# EAGLE design Gravador (EAGLE 6.6.0)
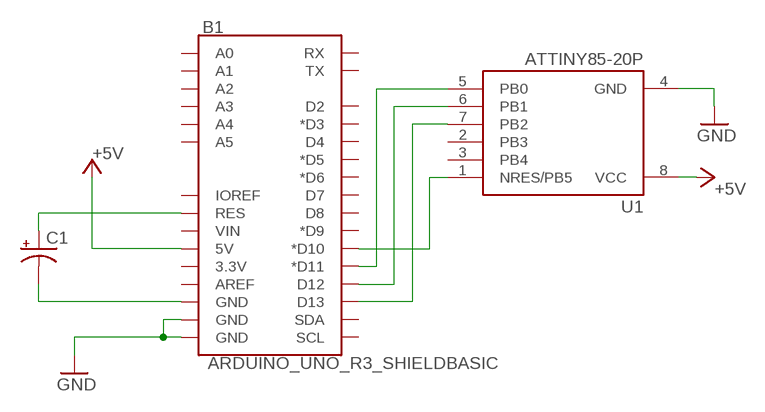
[diagram p0: schematic, sheet 1]

## Parts
B1  ARDUINO_UNO_R3_SHIELDBASIC  [UNO_R3_SHIELD]
C1  CPOL-USE2.5-5  [E2,5-5]
U1  ATTINY85-20P  [PDIP08_300MIL]

## Nets
+5V: B1.5V U1.8(VCC)
GND: B1.GND@0(GND) B1.GND@1(GND) U1.4(GND)
GND1: B1.GND@2(GND) C1.-
N$1: B1.RES C1.+
N$2: B1.D13 U1.7(PB2)
N$3: B1.D12 U1.6(PB1)
N$4: B1.D11(*D11) U1.5(PB0)
N$5: B1.D10(*D10) U1.1(NRES/PB5)
Unconnected: B1.3.3V B1.A0 B1.A1 B1.A2 B1.A3 B1.A4 B1.A5 B1.AREF B1.D2 B1.D3(*D3) B1.D4 B1.D5(*D5) B1.D6(*D6) B1.D7 B1.D8 B1.D9(*D9) B1.IOREF B1.RX B1.SCL B1.SDA B1.TX B1.VIN U1.2(PB3) U1.3(PB4)

## Library data of the parts
B1 = Robotica-IFRN-SC-Arduino:ARDUINO_UNO_R3_SHIELD: Arduino R3 Shield Footprint Shield form compatible with the Arduino Uno R3. SparkFun Products: MG2639 Cellular Shield <https://www.sparkfun.com/products/13120> MIDI Shield <https://www.sparkfun.com/products/12898> R3 Stackable Headers Kit <https://www.sparkfun.com/products/11417>
C1 = rcl:CPOL-US: POLARIZED CAPACITOR, American symbol
U1 = _hhn_attiny25_45_85:ATTINY85*: ATMEL ATtiny 85 Packages: P = PDIP 08 30mil S = SOIC 08 EIAJ 208mil Technologies Note: for complete ordering code (temp. range, finish, tape&reel etc.) see www.atmel.com • Supply Voltage: V = (1.8…5.5)V | [blank] = (2.7…5.5)V • Speed: 10 = 10 MHz | 20 = 20 MHz Author: Dipl.-Ing. FH Rainer Bayer HHN Hochschule Heilbronn (Heilbronn University), rainer.bayer@hs-heilbronn.de Ingenieurbüro ing-rb, mail@ing-rb.de

## Board
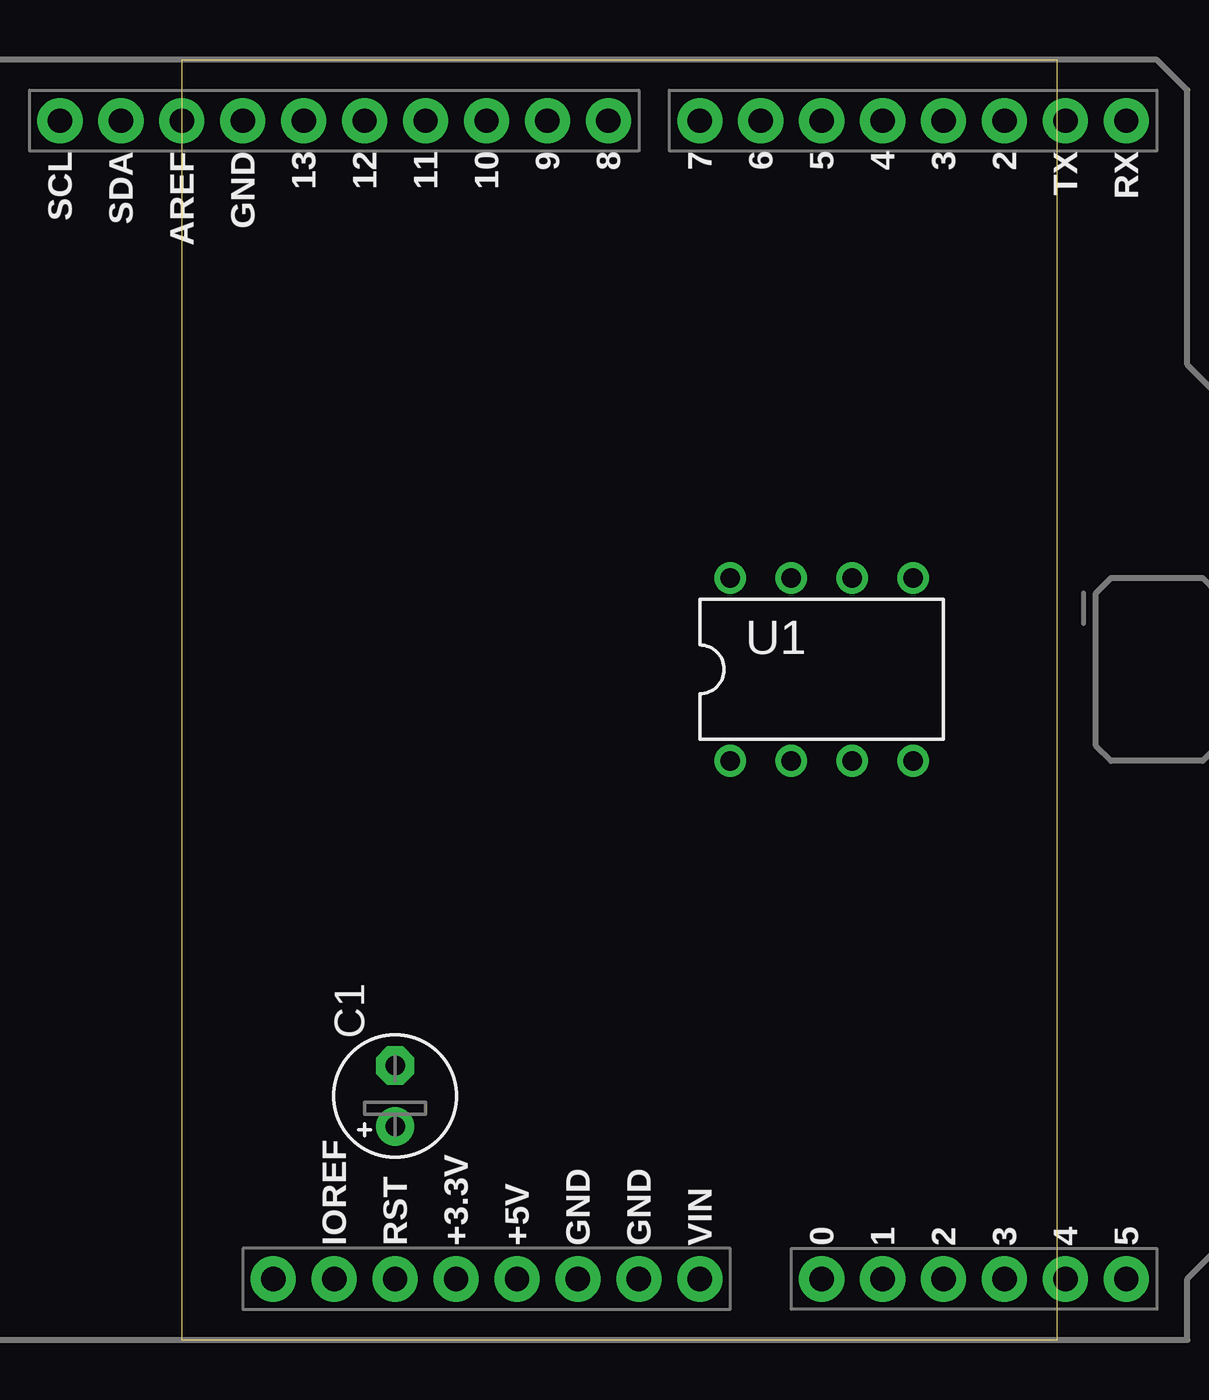
[diagram p1: board, top side]
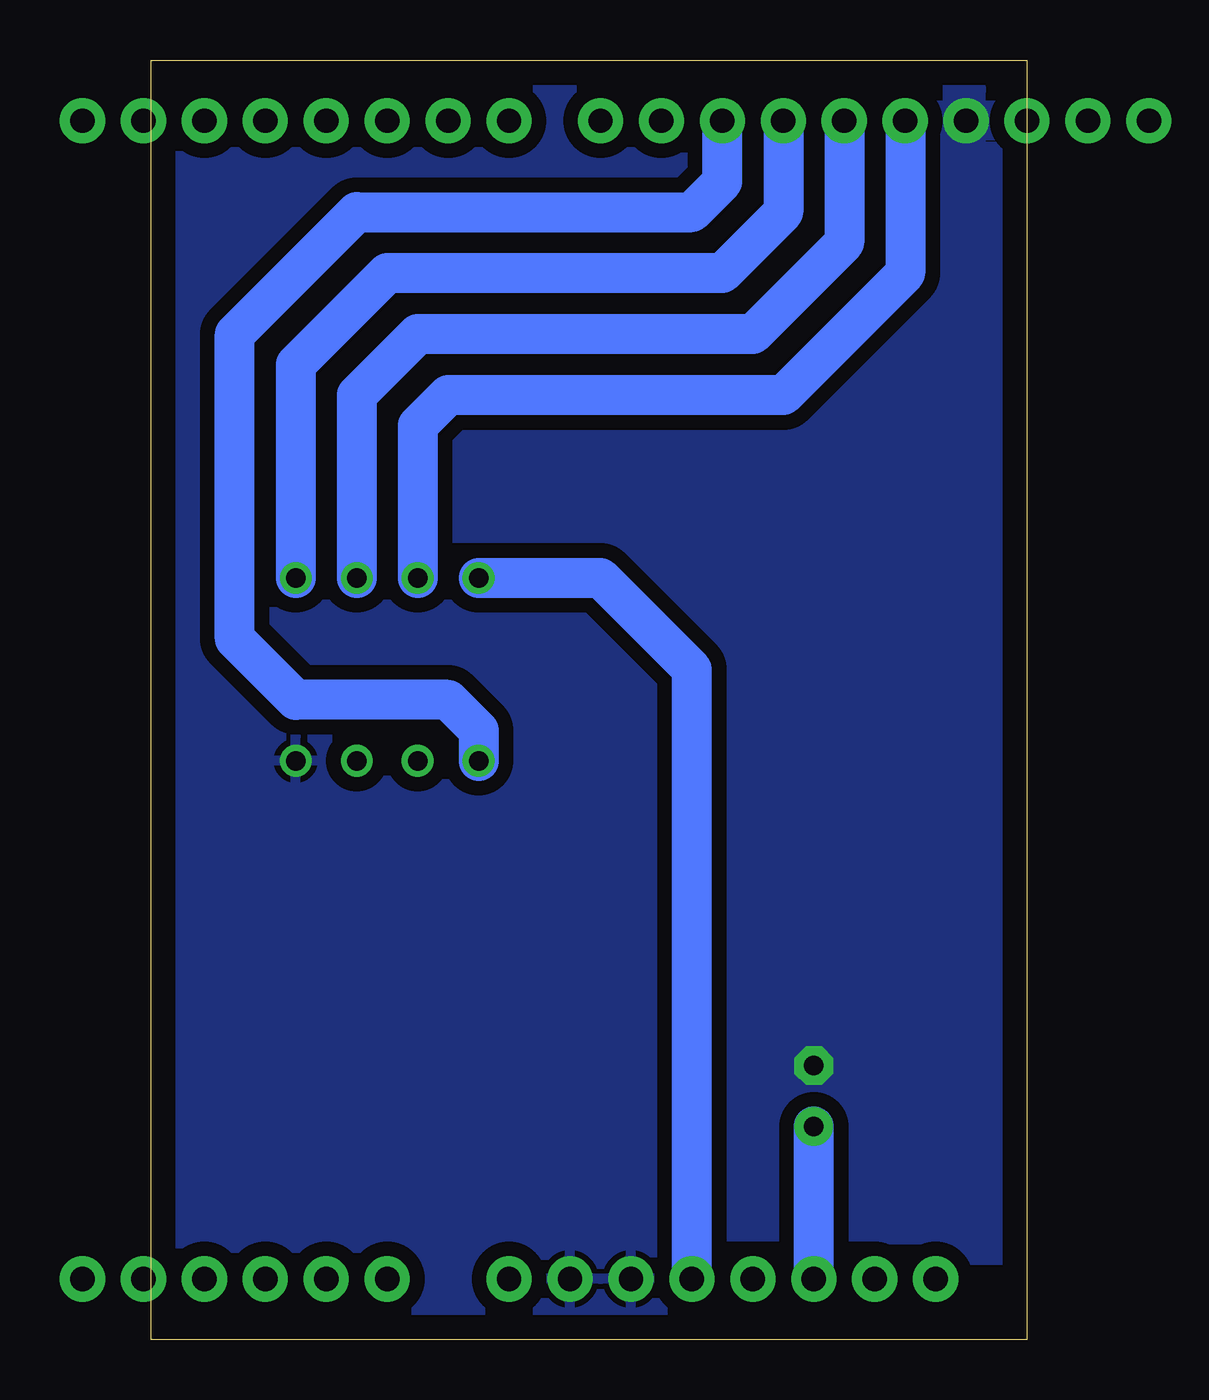
[diagram p2: board, bottom side, seen from below]

Size 36.5 x 53.33 mm. Coordinates in mm from the lower left corner, seen from the top.
Outline: 0,0 36.5,0 36.5,53.33 0,53.33 0,0
Copper layers (1*16): Top 0.035mm / dielectric 1.5mm / Bottom 0.035mm
Design rules "default *": minimum track width 10mil, minimum drill 24mil, track to track 24mil, track to pad 24mil, pad to pad 24mil, via to via 24mil, smd to smd 8mil, copper to edge 40mil, drill to drill 8mil, minimum pad ring 10mil, minimum via ring 8mil, stop-mask expansion 4mil, vias tented up to drill 0mil, thermal gap 10mil

### Footprints (pad centres in the part's own frame; a part is rotated, then mirrored left to right if it is on the bottom)
UNO_R3_SHIELD = drill 1.016 pad 1.88: 3.3V 24.13,-2.54; 5V 24.13,0; A0 24.13,12.7; A1 24.13,15.24; A2 24.13,17.78; A3 24.13,20.32; A4 24.13,22.86; A5 24.13,25.4; AREF -24.13,-13.97; D2 -24.13,20.32; D3 -24.13,17.78; D4 -24.13,15.24; D5 -24.13,12.7; D6 -24.13,10.16; D7 -24.13,7.62; D8 -24.13,3.81; D9 -24.13,1.27; D10 -24.13,-1.27; D11 -24.13,-3.81; D12 -24.13,-6.35; D13 -24.13,-8.89; GND@0 24.13,2.54; GND@1 24.13,5.08; GND@2 -24.13,-11.43; IOREF 24.13,-7.62; NC 24.13,-10.16; RES 24.13,-5.08; RX -24.13,25.4; SCL -24.13,-19.05; SDA -24.13,-16.51; TX -24.13,22.86; VIN 24.13,7.62
E2,5-5 = drill 0.813 pad 1.6: + -1.27,0 | drill 0.813 pad 1.6 octagon: - 1.27,0
PDIP08_300MIL = drill 0.813: 1 -3.81,-3.81; 2 -1.27,-3.81; 3 1.27,-3.81; 4 3.81,-3.81; 5 3.81,3.81; 6 1.27,3.81; 7 -1.27,3.81; 8 -3.81,3.81

### Placement (x,y rotation side)
B1  13.97,26.67 270 top
C1  8.89,10.16 90 top
U1  26.67,27.94 0 top

### Tracks (layer width: path | path; a pad name or v marks a point on that pad's centre or on a via)
+5V
  Bottom 1.676: B1.5V 13.97,27.94 17.78,31.75 U1.8
GND
  pour Bottom: 36.83,53.34 -2.54,53.34 -2.54,0 36.83,0
GND1
  pour Bottom: 1.27,54.61 25.4,54.61 25.4,1.27 1.27,1.27
N$1
  Bottom 1.676: B1.RES C1.+
N$2
  Bottom 1.676: B1.D13 5.08,44.45 10.16,39.37 24.13,39.37 25.4,38.1 U1.7
N$3
  Bottom 1.676: B1.D12 7.62,45.72 11.43,41.91 25.4,41.91 27.94,39.37 U1.6
N$4
  Bottom 1.676: B1.D11 10.16,46.99 12.7,44.45 26.67,44.45 30.48,40.64 U1.5
N$5
  Bottom 1.676: B1.D10 12.7,48.26 13.97,46.99 27.94,46.99 33.02,41.91 33.02,29.21 30.48,26.67 24.13,26.67 22.86,25.4 U1.1